# EAGLE design TriggerTrap User Interface 0v39 Release (EAGLE 6.2)
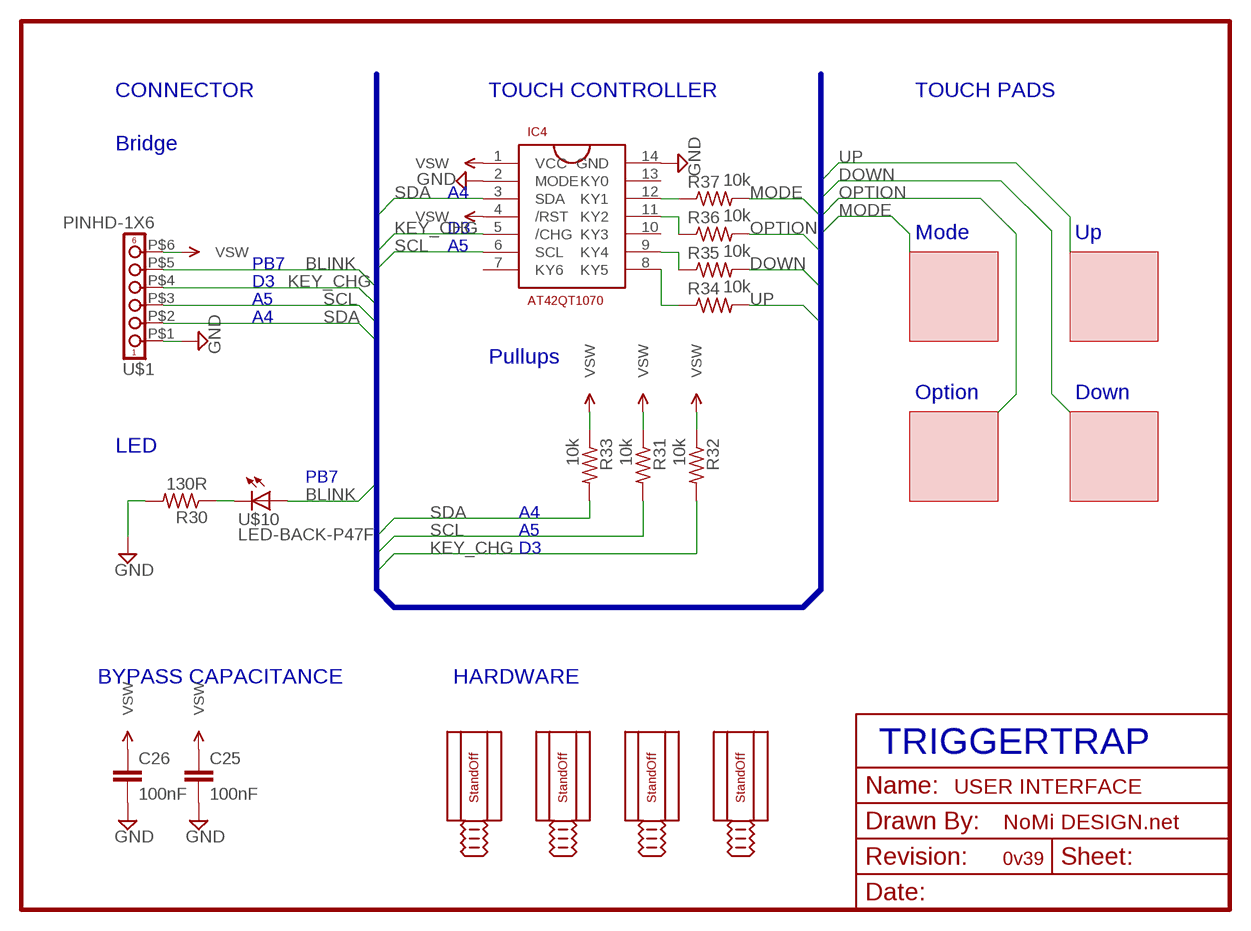
[diagram p0: schematic, sheet 1]

## Parts
C25  100nF  C-EUC0603K  [C0603K]
C26  100nF  C-EUC0603K  [C0603K]
IC4  AT42QT1070  [14SOIC]
R30  130R  R-US_R0603  [R0603]
R31  10k  R-US_R0603  [R0603]
R32  10k  R-US_R0603  [R0603]
R33  10k  R-US_R0603  [R0603]
R34  10k  R-US_R0603  [R0603]
R35  10k  R-US_R0603  [R0603]
R36  10k  R-US_R0603  [R0603]
R37  10k  R-US_R0603  [R0603]
U$1  PINHD-1X6  [PINHD-1X6-SMD]
U$2  STAND-0FF-3.2  [STAND-OFF]
U$10  LED-BACK-P47F  [LED-P47F]
U$23  STAND-0FF-3.2  [STAND-OFF]
U$24  STAND-0FF-3.2  [STAND-OFF]
U$25  STAND-0FF-3.2  [STAND-OFF]

## Nets
BLINK: U$1.P$5 U$10.A
DOWN: R35.2
GND: C25.2 C26.2 IC4.2(MODE) IC4.14(GND) R30.2 U$1.P$1
KEY_CHG: IC4.5(/CHG) R32.2 U$1.P$4
MODE: R37.2
N$1: IC4.12(KY1) R37.1
N$2: IC4.11(KY2) R36.1
N$3: IC4.9(KY4) R35.1
N$4: IC4.8(KY5) R34.1
N$8: R30.1 U$10.C
OPTION: R36.2
SCL: IC4.6(SCL) R31.2 U$1.P$3
SDA: IC4.3(SDA) R33.2 U$1.P$2
UP: R34.2
VSW: C25.1 C26.1 IC4.1(VCC) IC4.4(/RST) R31.1 R32.1 R33.1 U$1.P$6
Unconnected: IC4.7(KY6) IC4.10(KY3) IC4.13(KY0)

## Buses
B$1

## Notes on the sheet
- CONNECTOR | TOUCH CONTROLLER | TOUCH PADS
- Bridge
- A4
- D3
- Mode | Up
- A5
- PB7
- D3
- A5
- A4
- Pullups
- Option | Down
- LED
- PB7
- A4
- A5
- D3
- BYPASS CAPACITANCE | HARDWARE
- TRIGGERTRAP
- USER INTERFACE
- NoMi DESIGN.net
- 0v39

## Library data of the parts
C25 C26 = rcl:C-EU: CAPACITOR, European symbol
IC4 = TriggerTrap:AT42QT1070
R30-R37 = rcl:R-US_: RESISTOR, American symbol
U$1 = TriggerTrap:PINHD-1X6
U$2 U$23-U$25 = TriggerTrap:STAND-0FF-3.2
U$10 = TriggerTrap:LED-BACK-P47F

## Net classes
0 default: width 0.152 mm, drill 0.3 mm, clearance 0.152 mm
1 power: width 0.254 mm, drill 0.3 mm, clearance 0.152 mm

## Board
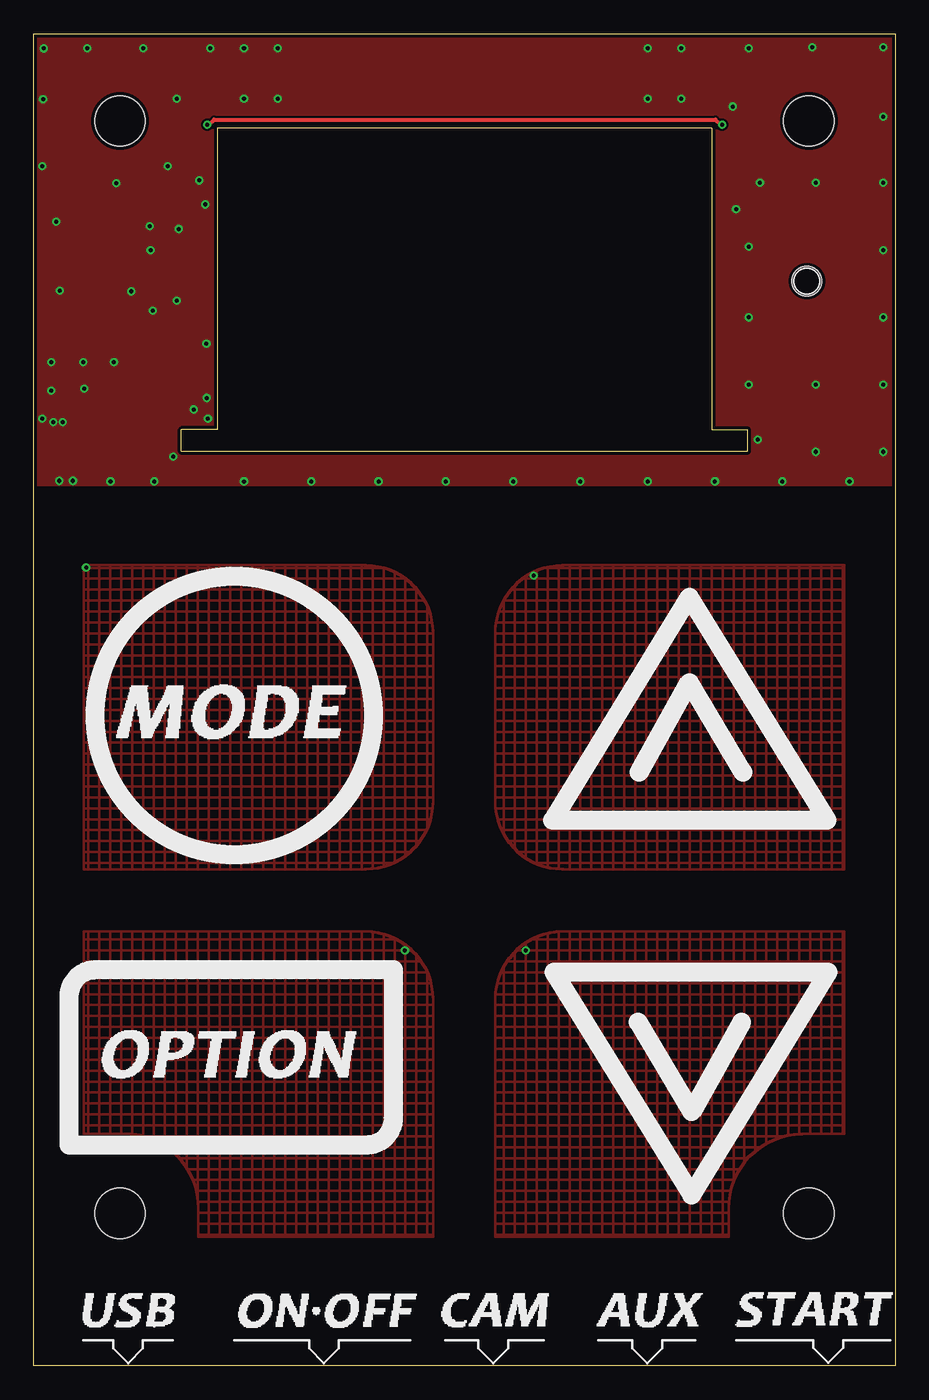
[diagram p1: board, top side]
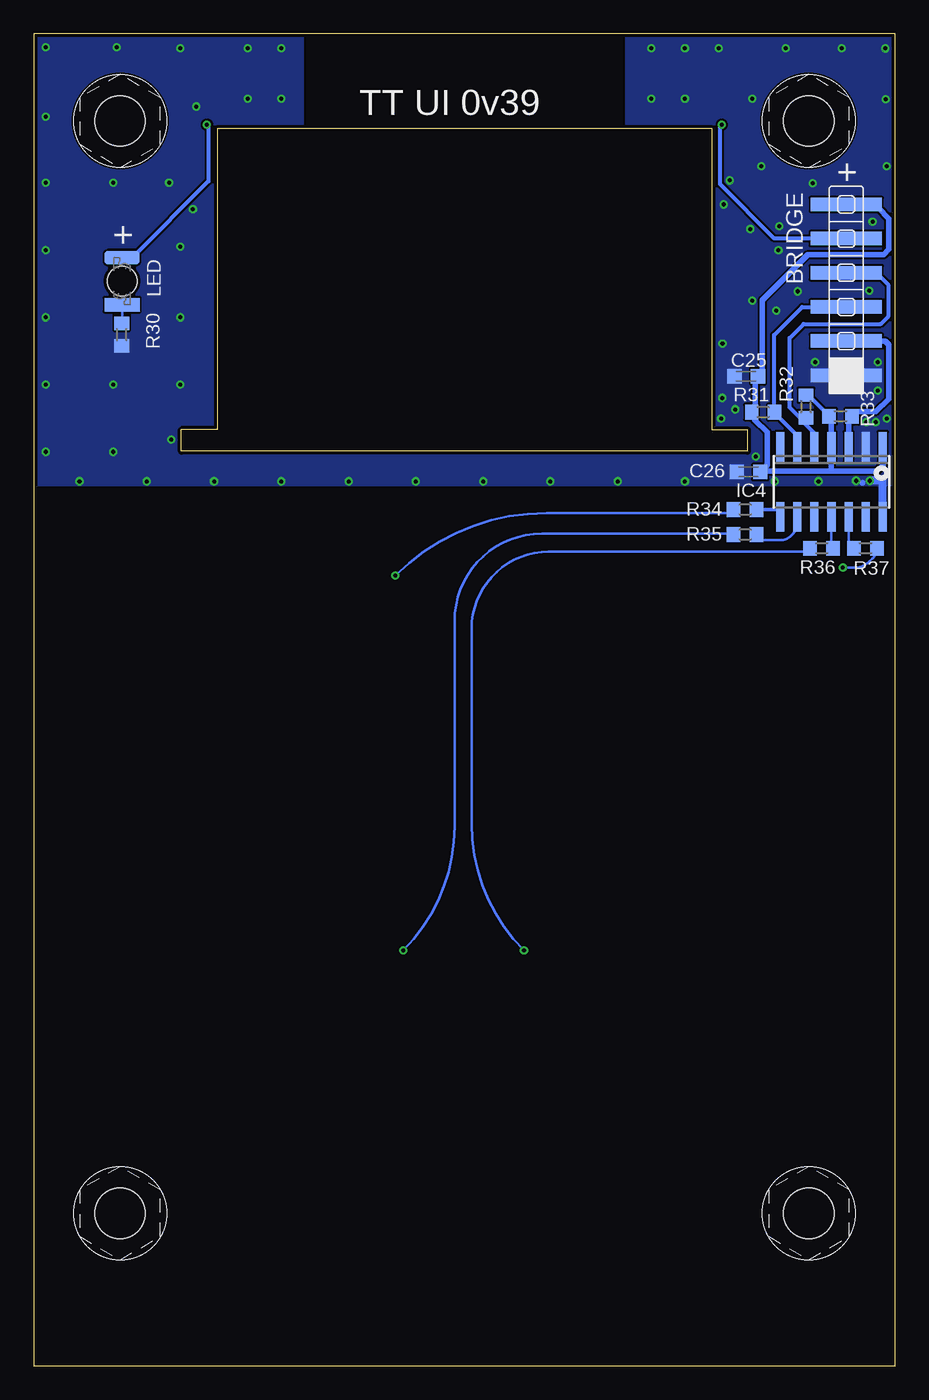
[diagram p2: board, bottom side, seen from below]

Size 64.04 x 99.05 mm. Coordinates in mm from the lower left corner, seen from the top.
Outline: 0,0 0,99.05 64.04,99.05 64.04,0 0,0
Outline: 50.4,92 13.65,92 13.65,69.6 10.97,69.6 10.97,68 53.07,68 53.07,69.6 50.4,69.6 50.4,92
Copper layers (1*16): Top 0.035mm / dielectric 1.5mm / Bottom 0.035mm
Design rules: minimum track width 6mil, minimum drill 0.3mm, track to track 6mil, track to pad 6mil, pad to pad 6mil, via to via 6mil, smd to smd 0mil, copper to edge 10mil, drill to drill 10mil, minimum pad ring 10mil, minimum via ring 6mil, stop-mask expansion 2mil, vias tented up to drill 100mil, thermal gap 10mil

### Footprints (pad centres in the part's own frame; a part is rotated, then mirrored left to right if it is on the bottom)
C0603K = smd 1.05 x 1.08: 1 -0.875,0; 2 0.875,0
14SOIC = smd 0.6 x 2.2: 1 -3.81,-2.6; 2 -2.54,-2.6; 3 -1.27,-2.6; 4 0,-2.6; 5 1.27,-2.6; 6 2.54,-2.6; 7 3.81,-2.6; 8 3.81,2.6; 9 2.54,2.6; 10 1.27,2.6; 11 0,2.6; 12 -1.27,2.6; 13 -2.54,2.6; 14 -3.81,2.6
R0603 = smd 1 x 1.1: 1 -0.85,0; 2 0.85,0
PINHD-1X6-SMD = smd 1 x 5.3: P$1 -6.35,0; P$2 -3.81,0; P$3 -1.27,0; P$4 1.27,0; P$5 3.81,0; P$6 6.35,0
STAND-OFF = hole 3.75: 0,0
LED-P47F = smd 1 x 2.6: A -1.75,0; C 1.75,0 | hole 2.2: 0,0

### Placement (x,y rotation side)
C25  11.08,73.58 180 bottom
C26  10.92,66.46 180 bottom
IC4  4.75,65.73 180 bottom
R30  57.5,76.67 270 bottom
R31  9.82,70.91 0 bottom
R32  6.64,71.32 270 bottom
R33  4.07,70.6 0 bottom
R34  11.17,63.66 180 bottom
R35  11.17,61.81 180 bottom
R36  5.48,60.78 180 bottom
R37  2.22,60.78 0 bottom
U$1  3.65,80 90 bottom
U$2  57.62,11.35 0 bottom
U$10  57.47,80.64 270 bottom
U$23  6.42,11.35 0 bottom
U$24  6.42,92.56 0 bottom
U$25  57.62,92.56 0 bottom

### Tracks (layer width: path | path; a pad name or v marks a point on that pad's centre or on a via)
BLINK  (via drill 0.3)
  Top 0.305: v12.91,92.27 v12.92,92.28 13.03,92.28 13.41,92.66 50.67,92.66 51.05,92.28 v51.17,92.28 | v51.17,92.28
  Bottom 0.305: 57.57,82.37 57.49,82.37 U$10.A 57.41,82.45 56.69,82.45 51.06,88.08 51.06,92.14 51.17,92.24 v51.17,92.28 | U$1.P$5 8.98,83.81 13.03,87.86 13.03,92.15 v12.91,92.27 12.88,92.24
DOWN  (via drill 0.3)
  Bottom 0.203: v36.57,30.9 arc-45 32.76,40.1 32.76,55.38 arc90 26.26,61.88 12.09,61.88 R35.2
  pour Top (no thermals, hatched): 60.26,32.31 60.26,17.24 57.12,17.23 arc88 51.66,11.68 51.66,9.6 34.29,9.6 34.29,27.31 arc-90 39.29,32.31
GND  (via drill 0.3)
  Bottom 0.406: 2.46,65.64 2.41,65.68
  Bottom 0.61: IC4.14 0.94,65.8 v1.91,65.8
  other vias: 5.71,65.76 8.96,65.76 15.63,65.76 20.64,65.76 25.64,65.76 30.64,65.76 35.63,65.76 40.63,65.76 45.63,65.76 50.63,65.76 55.63,65.76 60.63,65.76 53.82,68.87 58.13,67.96 63.13,67.96 53.13,72.96 58.13,72.96 63.13,72.96 53.13,77.96 63.13,77.96 63.13,82.96 58.13,87.96 53.13,83.21 52.2,86.01 63.13,87.96 51.95,93.63 53.13,97.96 48.13,97.96 45.63,97.96 15.63,97.96 18.14,97.96 13.13,97.96 8.13,97.96 48.13,94.21 45.63,94.21 18.14,94.21 15.63,94.21 10.63,94.21 9.96,89.21 10.78,84.53 10.63,79.21 0.76,97.95 0.7,94.16 6.14,87.93 7.24,79.89 8.85,78.44 1.95,79.93 0.64,89.21 0.64,70.42 1.31,72.52 3.76,72.67 1.31,74.63 3.68,74.63 5.97,74.63 2.16,70.15 1.45,70.15 12.95,70.43 2.92,65.8 12.88,71.97 53.98,87.96 57.88,98.04 63.16,92.87 63.13,98.03 3.99,97.96 8.69,82.94 12.74,86.35 1.69,85.08 8.64,84.74 12.32,88.14 11.89,71.11 12.84,76.01 10.36,67.61
  pour Bottom (no thermals): 64.37,65.5 64.37,99.36 44.04,99.36 44.04,91.14 20,91.14 20,99.36 -0.24,99.36 -0.24,65.5
  pour Top (no thermals): 64.37,99.38 -0.24,99.38 -0.24,65.5 64.37,65.5
KEY_CHG
  Bottom 0.305: U$1.P$4 3.57,81.19 1.35,81.19 0.51,80.34 0.51,78.06 1.1,77.46 6.82,77.46 7.85,76.43 7.85,71.25 7.01,70.41 6.86,70.41 | IC4.5 6.02,69.34 6.86,70.18 6.86,70.41 | 6.86,70.41 6.86,70.48 6.78,70.56 6.73,70.56 R32.2
MODE  (via drill 0.3)
  Bottom 0.203: 1.68,60.58 1.68,60.78 R37.2 1.45,60.46 arc30 1.71,60.01 1.89,59.84 arc45 3.07,59.35 v3.89,59.35
  pour Top (no thermals, hatched): 3.71,59.53 24.69,59.53 arc-90 29.69,54.53 29.69,41.91 arc-90 24.69,36.91 3.71,36.91
N$1
  Bottom 0.203: IC4.12 3.48,60.89 R37.1
N$2
  Bottom 0.203: IC4.11 4.75,60.97 R36.1
N$3
  Bottom 0.203: R35.1 9.9,61.39 8.58,61.39 arc-90 7.32,62.66 7.32,63.1 IC4.9
N$4
  Bottom 0.254: R34.1 8.65,63.66 8.61,63.7 8.61,63.18 IC4.8
N$8
  Bottom 0.203: U$10.C 57.47,77.68 R30.1
OPTION  (via drill 0.3)
  Bottom 0.203: v27.6,30.9 arc45 31.49,40.3 31.49,54.81 arc90 25.77,60.53 6.66,60.53 R36.2
  pour Top (no thermals, hatched): 3.71,32.31 24.69,32.31 arc-90 29.69,27.31 29.69,9.6 12.23,9.6 12.23,11.69 arc90 6.68,17.24 3.71,17.24
SCL
  Bottom 0.305: R31.2 8.81,70.53 8.77,70.56 8.69,70.56 7.29,69.16 IC4.6 | R31.2 9.12,70.83 | R31.2 9.14,70.86 | U$1.P$3 6.93,78.73 9.02,76.64 9.02,70.65 R31.2
SDA
  Bottom 0.406: U$1.P$2 0.76,76.19 0.51,75.94 0.51,71.88 1.44,70.94 2.88,70.94 R33.2 3.48,70.34 IC4.3
UP  (via drill 0.3)
  Bottom 0.203: R34.2 12.02,63.58 12.18,63.41 25.92,63.41 arc-45 v37.16,58.75
  pour Top (no thermals, hatched): 60.26,59.53 60.26,36.91 39.29,36.91 arc-90 34.29,41.91 34.29,54.53 arc-90 39.29,59.53
VSW
  Bottom 0.305: R32.1 6.49,72.17 5.03,70.71 5.03,70.7 R33.1
  Bottom 0.406: 6.27,66.52 6.27,66.53 | R31.1 10.69,70.71 | R31.1 10.41,70.95 10.41,73.29 C25.1 9.91,73.5 9.91,79.25 6.53,82.63 0.88,82.63 0.47,83.03 0.47,85.3 1.27,86.1 1.61,86.1 1.86,86.35 U$1.P$6 | 4.72,66.52 1.37,66.52 0.91,66.98 0.91,68.31 IC4.1 | 4.72,66.52 6.27,66.52 | 4.72,66.52 4.75,66.55 IC4.4 4.75,70.39 4.72,70.41 4.74,70.41 R33.1 | R31.1 10.63,70.6 10.44,70.41 10.44,70.33 9.53,69.42 9.53,66.98 C26.1 9.98,66.52 6.27,66.52

### Text on the board
bPlace: TT UI 0v39
bNames: + | + | LED | BRIDGE